# EAGLE schematic shield (EAGLE 7.6.0)
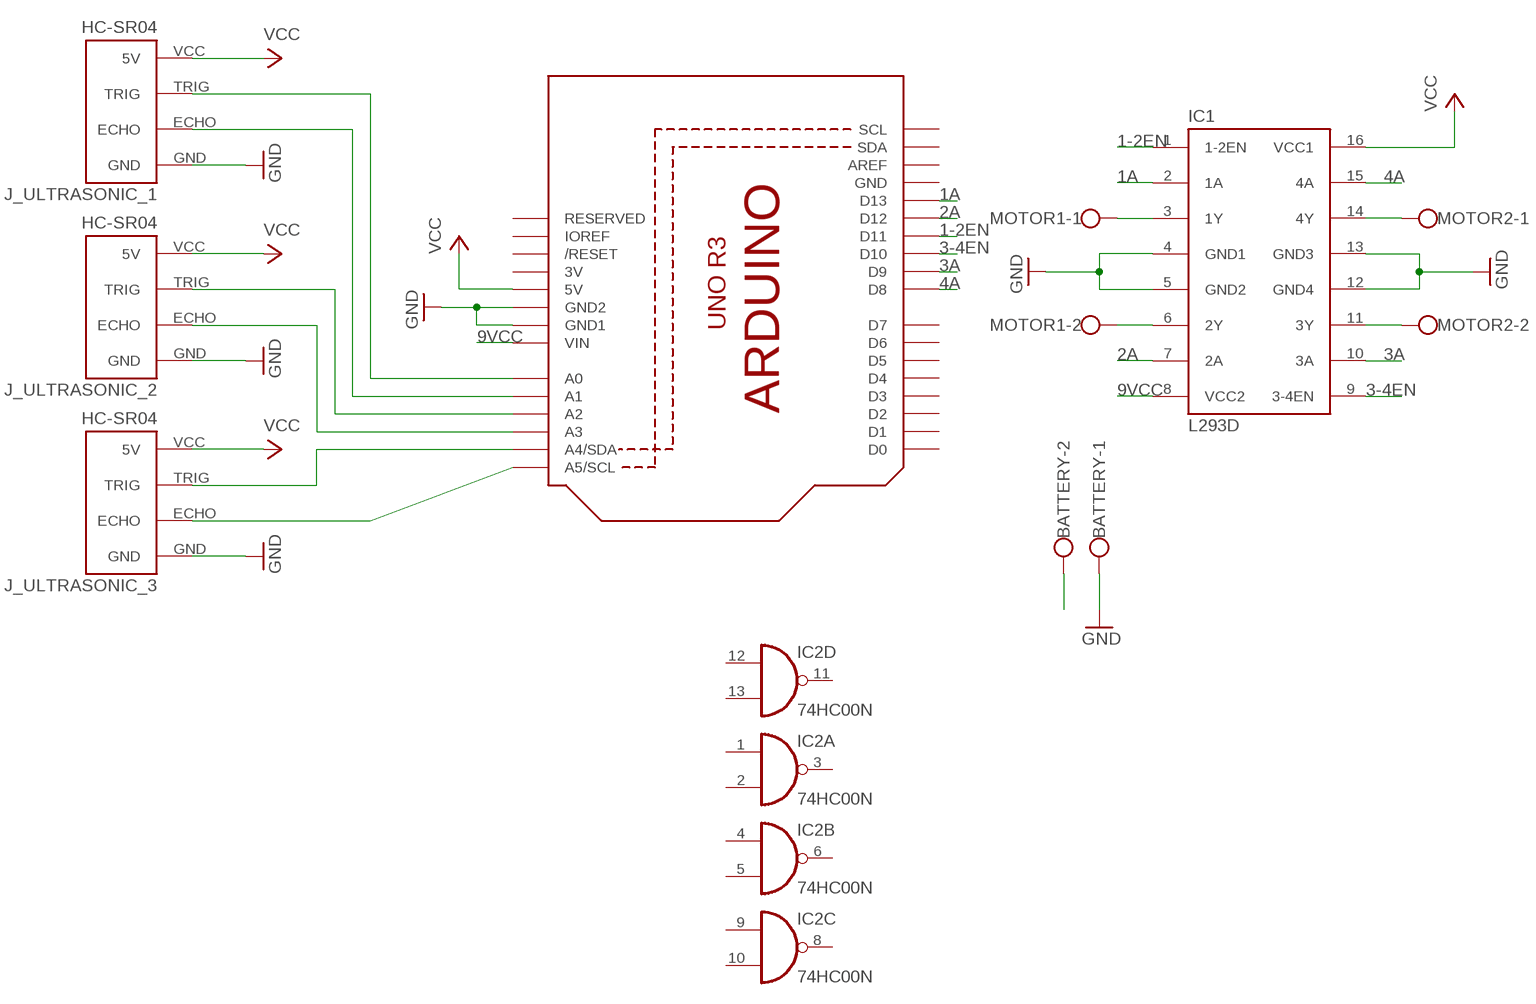
[diagram p0: schematic, sheet 1]

## Parts
BATTERY  W237-102  [W237-102]
IC1  L293D  [DIL16]
IC2  74HC00N  [DIL14]
J_ULTRASONIC_1  HC-SR04  [HC-SR04_FOOTPRINT]
J_ULTRASONIC_2  HC-SR04  [HC-SR04_FOOTPRINT]
J_ULTRASONIC_3  HC-SR04  [HC-SR04_FOOTPRINT]
MOTOR1  W237-102  [W237-102]
MOTOR2  W237-102  [W237-102]
U1  ARDUINOR3-BPLACE  [ARDUINOR3-BPLACE]

## Nets
1-2EN: IC1.1(1-2EN) U1.D11
1A: IC1.2(1A) U1.D13
2A: IC1.7(2A) U1.D12
3-4EN: IC1.9(3-4EN) U1.D10
3A: IC1.10(3A) U1.D9
4A: IC1.15(4A) U1.D8
9VCC: BATTERY.2 IC1.8(VCC2) U1.VIN
GND: BATTERY.1 IC1.4(GND1) IC1.5(GND2) IC1.12(GND4) IC1.13(GND3) J_ULTRASONIC_1.GND J_ULTRASONIC_2.GND J_ULTRASONIC_3.GND U1.GND1 U1.GND2
N$1: J_ULTRASONIC_1.TRIG U1.A0
N$2: J_ULTRASONIC_1.ECHO U1.A1
N$3: J_ULTRASONIC_2.TRIG U1.A2
N$4: J_ULTRASONIC_2.ECHO U1.A3
N$5: J_ULTRASONIC_3.TRIG U1.A4(A4/SDA)
N$6: J_ULTRASONIC_3.ECHO U1.A5(A5/SCL)
N$7: IC1.3(1Y) MOTOR1.1
N$8: IC1.6(2Y) MOTOR1.2
N$9: IC1.14(4Y) MOTOR2.1
N$10: IC1.11(3Y) MOTOR2.2
VCC: IC1.16(VCC1) J_ULTRASONIC_1.VCC(5V) J_ULTRASONIC_2.VCC(5V) J_ULTRASONIC_3.VCC(5V) U1.5V
Unconnected: IC2.1(A:I0) IC2.2(A:I1) IC2.3(A:O) IC2.4(B:I0) IC2.5(B:I1) IC2.6(B:O) IC2.8(C:O) IC2.9(C:I0) IC2.10(C:I1) IC2.11(D:O) IC2.12(D:I0) IC2.13(D:I1) U1.AREF U1.D0 U1.D1 U1.D2 U1.D3 U1.D4 U1.D5 U1.D6 U1.D7 U1.IOREF U1.RESERVED U1.RESET(/RESET) U1.SCL U1.SDA

## Power pins joined to a net without a drawn wire
3V: U1.3V
GND: IC2.7(P:GND) U1.GND
VCC: IC2.14(P:VCC)

## Library data of the parts
BATTERY MOTOR1 MOTOR2 = con-wago-500:W237-102: WAGO SCREW CLAMP; MPN: 237-102; OC_FARNELL: unknown; OC_NEWARK: 70K9898
IC1 = st-microelectronics:L293D: PUSH-PULL 4 CHANNEL DRIVER; MPN: L293D; OC_FARNELL: 9589619; OC_NEWARK: 56P8249
IC2 = 74xx-eu:74*00: Quad 2-input NAND gate
J_ULTRASONIC_1-J_ULTRASONIC_3 = HCSR04:HC-SR04: Ultrasonic Sensor HC-SR04
U1 = adafruit:ARDUINOR3: This is a new object for the new Arduino R3 - with extra pins that you may want to use (such as IOref, and duplicated A4/A5